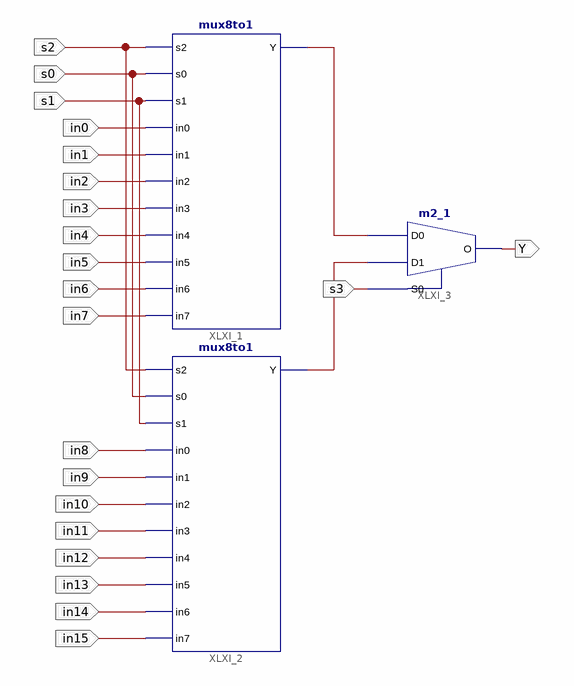
[diagram p0: schematic sheet 1]
// Xilinx ISE schematic mux8to1_16bit.sch (spartan6) as structural Verilog: 3 symbols, 21 ports
module mux8to1_16bit (
  input  s1,
  input  s0,
  input  s2,
  input  s3,
  input  in3,
  input  in2,
  input  in1,
  input  in4,
  input  in5,
  input  in6,
  input  in7,
  input  in8,
  input  in9,
  input  in10,
  input  in11,
  input  in12,
  input  in13,
  input  in14,
  input  in15,
  input  in0,
  output Y
);

  wire XLXN_1, XLXN_2;

  mux8to1 XLXI_1 (
    .s2(s2), .s0(s0), .s1(s1), .in0(in0), .in1(in1), .in2(in2), .in3(in3), .in4(in4), .in5(in5), .in6(in6),
    .in7(in7), .Y(XLXN_1));
  mux8to1 XLXI_2 (
    .s2(s2), .s0(s0), .s1(s1), .in0(in8), .in1(in9), .in2(in10), .in3(in11), .in4(in12), .in5(in13),
    .in6(in14), .in7(in15), .Y(XLXN_2));
  m2_1 XLXI_3 (.D0(XLXN_1), .D1(XLXN_2), .S0(s3), .O(Y));
endmodule
